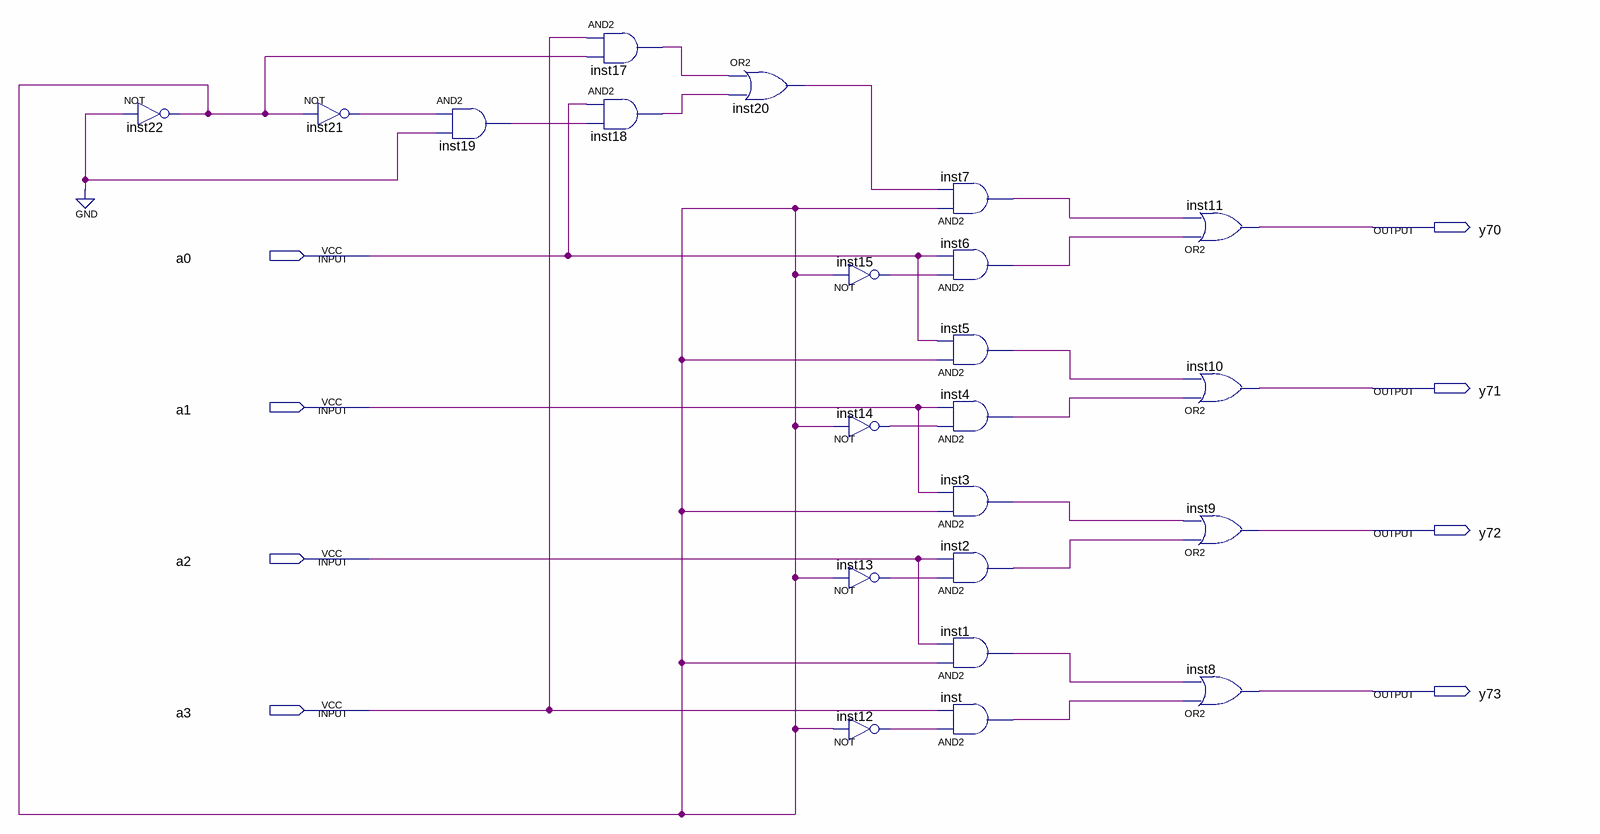
[diagram p0: schematic sheet]
// Quartus schematic leftroll.bdf as structural Verilog: 22 symbols, 8 pins
module leftroll (
  input  a0,
  input  a1,
  input  a2,
  input  a3,
  output y70,
  output y71,
  output y72,
  output y73
);

  wire inst1_out, inst2_out, inst3_out, inst4_out, inst5_out, inst6_out, inst7_out, inst12_out, inst13_out,
       inst14_out, inst15_out, inst17_out, inst18_out, inst19_out, inst20_out, inst21_out, inst22_out,
       inst_out;

  not inst22 (inst22_out, 1'b0);
  not inst21 (inst21_out, inst22_out);
  and inst19 (inst19_out, inst21_out, 1'b0);
  and inst17 (inst17_out, a3, inst22_out);
  and inst18 (inst18_out, a0, inst19_out);
  or inst20 (inst20_out, inst17_out, inst18_out);
  not inst15 (inst15_out, inst22_out);
  not inst14 (inst14_out, inst22_out);
  not inst13 (inst13_out, inst22_out);
  not inst12 (inst12_out, inst22_out);
  and inst7 (inst7_out, inst22_out, inst20_out);
  and inst6 (inst6_out, inst15_out, a0);
  and inst5 (inst5_out, inst22_out, a0);
  and inst4 (inst4_out, inst14_out, a1);
  and inst3 (inst3_out, inst22_out, a1);
  and inst2 (inst2_out, inst13_out, a2);
  and inst1 (inst1_out, inst22_out, a2);
  and inst (inst_out, inst12_out, a3);
  or inst11 (y70, inst6_out, inst7_out);
  or inst10 (y71, inst4_out, inst5_out);
  or inst9 (y72, inst2_out, inst3_out);
  or inst8 (y73, inst_out, inst1_out);
endmodule
